# Altium schematic sheet PGOODs.SchDoc
size A; SheetNumber: 7; SheetTotal: 8
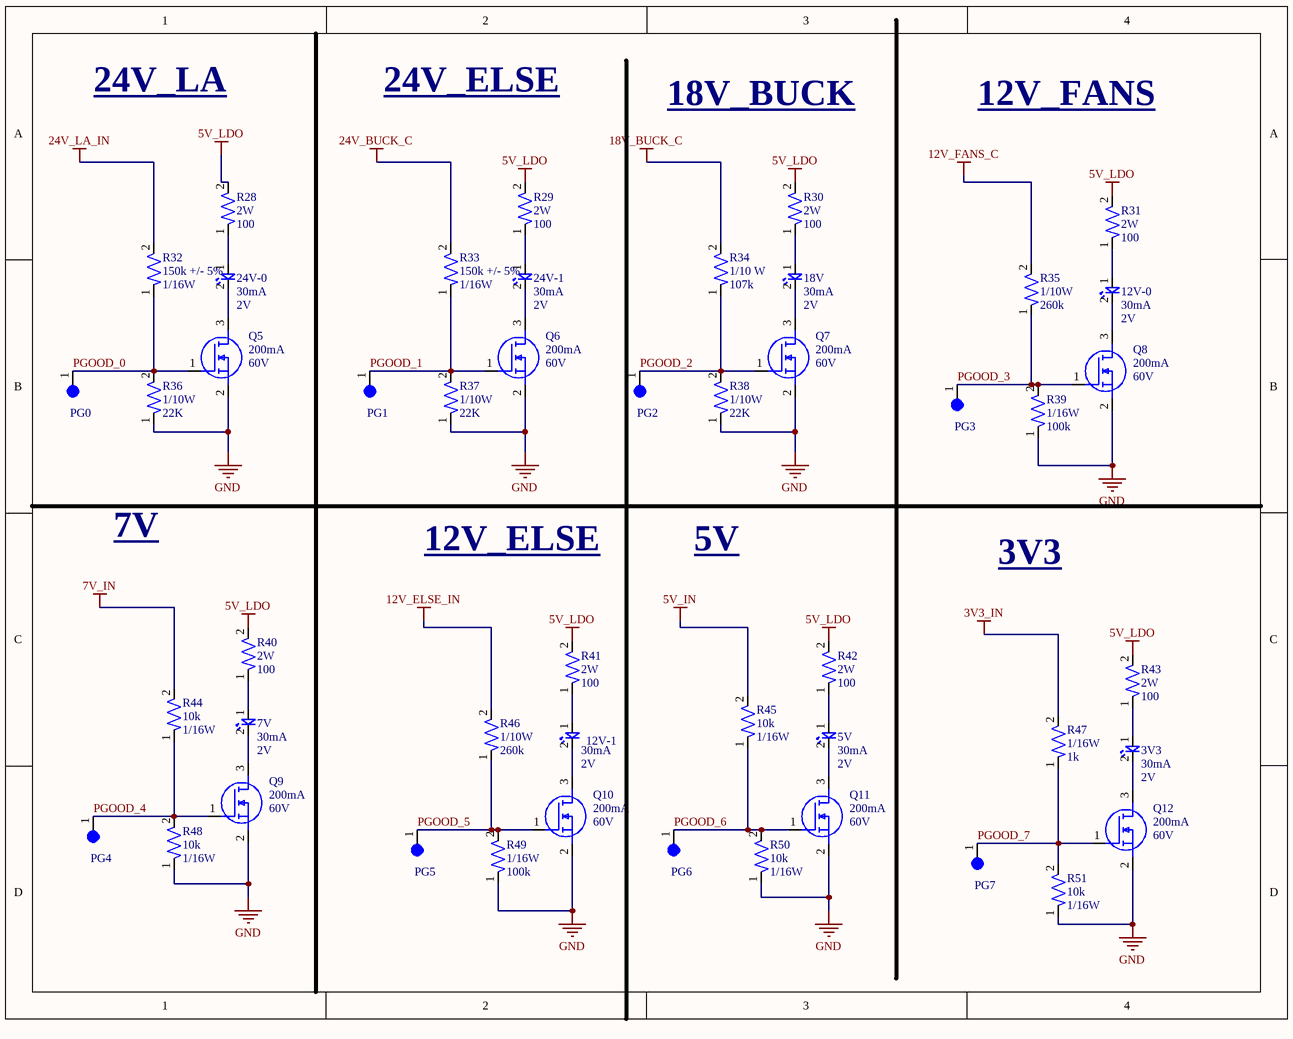
[diagram p0: PGOODs.SchDoc]

## Parts
3V3  Forward Current: 30mA  Forward Voltage: 2V  [LED-0603]  (hidden comment: BL-HKC36G-AV-TRB)
5V  Forward Current: 30mA  Forward Voltage: 2V  [LED-0603]  (hidden comment: BL-HKC36G-AV-TRB)
7V  Forward Current: 30mA  Forward Voltage: 2V  [LED-0603]  (hidden comment: BL-HKC36G-AV-TRB)
12V-0  Forward Current: 30mA  Forward Voltage: 2V  [LED-0603]  (hidden comment: BL-HKC36G-AV-TRB)
12V-1  Forward Current: 30mA  Forward Voltage: 2V  [LED-0603]  (hidden comment: BL-HKC36G-AV-TRB)
18V  Forward Current: 30mA  Forward Voltage: 2V  [LED-0603]  (hidden comment: BL-HKC36G-AV-TRB)
24V-0  Forward Current: 30mA  Forward Voltage: 2V  [LED-0603]  (hidden comment: BL-HKC36G-AV-TRB)
24V-1  Forward Current: 30mA  Forward Voltage: 2V  [LED-0603]  (hidden comment: BL-HKC36G-AV-TRB)
PG0  5003  [TEST-POINT-0001]  (value not drawn)
PG1  5003  [TEST-POINT-0001]  (value not drawn)
PG2  5003  [TEST-POINT-0001]  (value not drawn)
PG3  5003  [TEST-POINT-0001]  (value not drawn)
PG4  5003  [TEST-POINT-0001]  (value not drawn)
PG5  5003  [TEST-POINT-0001]  (value not drawn)
PG6  5003  [TEST-POINT-0001]  (value not drawn)
PG7  5003  [TEST-POINT-0001]  (value not drawn)
Q5  Continuous Current: 200mA  Voltage: 60V  [IC-SOT23-3]  (hidden comment: T2N7002AK,LM)
Q6  Continuous Current: 200mA  Voltage: 60V  [IC-SOT23-3]  (hidden comment: T2N7002AK,LM)
Q7  Continuous Current: 200mA  Voltage: 60V  [IC-SOT23-3]  (hidden comment: T2N7002AK,LM)
Q8  Continuous Current: 200mA  Voltage: 60V  [IC-SOT23-3]  (hidden comment: T2N7002AK,LM)
Q9  Continuous Current: 200mA  Voltage: 60V  [IC-SOT23-3]  (hidden comment: T2N7002AK,LM)
Q10  Continuous Current: 200mA  Voltage: 60V  [IC-SOT23-3]  (hidden comment: T2N7002AK,LM)
Q11  Continuous Current: 200mA  Voltage: 60V  [IC-SOT23-3]  (hidden comment: T2N7002AK,LM)
Q12  Continuous Current: 200mA  Voltage: 60V  [IC-SOT23-3]  (hidden comment: T2N7002AK,LM)
R28  Power: 2W  Resistance: 100  [RES-2512]  (hidden comment: SR2512JK-7W100RL)
R29  Power: 2W  Resistance: 100  [RES-2512]  (hidden comment: SR2512JK-7W100RL)
R30  Power: 2W  Resistance: 100  [RES-2512]  (hidden comment: SR2512JK-7W100RL)
R31  Power: 2W  Resistance: 100  [RES-2512]  (hidden comment: SR2512JK-7W100RL)
R32  Resistance: 150k +/- 5%  Power: 1/16W  [RES-0402]  (hidden comment: RC0603FR-0722KL)
R33  Resistance: 150k +/- 5%  Power: 1/16W  [RES-0402]  (hidden comment: *RC0402JR-07150KL)
R34  Power: 1/10 W  Resistance: 107k  [RES-0603]  (hidden comment: RC0603FR-07107KL)
R35  Power: 1/10W  Resistance: 260k  [RES-0402]  (hidden comment: ERJ-2RKF2743X)
R36  Power: 1/10W  Resistance: 22K  [RES-0603]  (hidden comment: RC0603FR-0722KL)
R37  Power: 1/10W  Resistance: 22K  [RES-0603]  (hidden comment: RC0603FR-0722KL)
R38  Power: 1/10W  Resistance: 22K  [RES-0603]  (hidden comment: RC0603FR-0722KL)
R39  Power: 1/16W  Resistance: 100k  [RES-0402]  (hidden comment: RC0402FR-07100KL)
R40  Power: 2W  Resistance: 100  [RES-2512]  (hidden comment: SR2512JK-7W100RL)
R41  Power: 2W  Resistance: 100  [RES-2512]  (hidden comment: SR2512JK-7W100RL)
R42  Power: 2W  Resistance: 100  [RES-2512]  (hidden comment: SR2512JK-7W100RL)
R43  Power: 2W  Resistance: 100  [RES-2512]  (hidden comment: SR2512JK-7W100RL)
R44  Resistance: 10k  Power: 1/16W  [RES-0402]  (hidden comment: RC0402FR-0710KL)
R45  Resistance: 10k  Power: 1/16W  [RES-0402]  (hidden comment: RC0402FR-0710KL)
R46  Power: 1/10W  Resistance: 260k  [RES-0402]  (hidden comment: ERJ-2RKF2743X)
R47  Power: 1/16W  Resistance: 1k  [RES-0402]  (hidden comment: RC0402FR-071KL)
R48  Resistance: 10k  Power: 1/16W  [RES-0402]  (hidden comment: RC0402FR-0710KL)
R49  Power: 1/16W  Resistance: 100k  [RES-0402]  (hidden comment: RC0402FR-07100KL)
R50  Resistance: 10k  Power: 1/16W  [RES-0402]  (hidden comment: RC0402FR-0710KL)
R51  Resistance: 10k  Power: 1/16W  [RES-0402]  (hidden comment: RC0402FR-0710KL)

## Nets
3V3_IN: R47.2
5V_IN: R45.2
5V_LDO: R28.2 R29.2 R30.2 R31.2 R40.2 R41.2 R42.2 R43.2
7V_IN: R44.2
12V_ELSE_IN: R46.2
12V_FANS_C: R35.2
18V_BUCK_C: R34.2
24V_BUCK_C: R33.2
24V_LA_IN: R32.2
GND: Q5.2(S) Q6.2(S) Q7.2(S) Q8.2(S) Q9.2(S) Q10.2(S) Q11.2(S) Q12.2(S) R36.1 R37.1 R38.1 R39.1 R48.1 R49.1 R50.1 R51.1
PGOOD_0: PG0.1 Q5.1(G) R32.1 R36.2
PGOOD_1: PG1.1 Q6.1(G) R33.1 R37.2
PGOOD_2: PG2.1 Q7.1(G) R34.1 R38.2
PGOOD_3: PG3.1 Q8.1(G) R35.1 R39.2
PGOOD_4: PG4.1 Q9.1(G) R44.1 R48.2
PGOOD_5: PG5.1 Q10.1(G) R46.1 R49.2
PGOOD_6: PG6.1 Q11.1(G) R45.1 R50.2
PGOOD_7: PG7.1 Q12.1(G) R47.1 R51.2
Net3V3_1: 3V3.1 R43.1
Net3V3_2: 3V3.2 Q12.3(D)
Net5V_1: 5V.1 R42.1
Net5V_2: 5V.2 Q11.3(D)
Net7V_1: 7V.1 R40.1
Net7V_2: 7V.2 Q9.3(D)
Net12V-0_1: 12V-0.1 R31.1
Net12V-0_2: 12V-0.2 Q8.3(D)
Net12V-1_1: 12V-1.1 R41.1
Net12V-1_2: 12V-1.2 Q10.3(D)
Net18V_1: 18V.1 R30.1
Net18V_2: 18V.2 Q7.3(D)
Net24V-0_1: 24V-0.1 R28.1
Net24V-0_2: 24V-0.2 Q5.3(D)
Net24V-1_1: 24V-1.1 R29.1
Net24V-1_2: 24V-1.2 Q6.3(D)

## Notes on the sheet
- 24V_LA
- 24V_ELSE
- 18V_BUCK
- 12V_FANS
- 7V
- 12V_ELSE
- 5V
- 3V3

## Library data of the parts
3V3 5V 7V 12V-0 12V-1 18V 24V-0 24V-1 = LED-0001: LED YELLOW CLEAR 0603 SMD; ComponentLink1Description: Datasheet; ComponentLink1URL: https://www.americanbrightled.com/pdffiles/led-components/smt/BL-HKC36G-AV-TRB.pdf
PG0-PG7 = TEST-POINT-0001: Oranange PC Test Point, Miniature Phoisphor Bronze Silver Plating Through Hole Mounting Type
Q5-Q12 = NMOS-200MA-0001: MOSFET N-CH 60V 200MA SOT23; ComponentLink1Description: Datasheet; ComponentLink1URL: https://toshiba.semicon-storage.com/info/T2N7002AK_datasheet_en_20150401.pdf?did=29712&prodName=T2N7002AK
R28-R31 R40-R43 = RES-100-0002: 100 Ohms ±5% 2W Chip Resistor 2512 (6332 Metric) Automotive AEC-Q200, Pulse Withstanding Thick Film
R32 R33 = RES-150K-0001: 150 kOhms ±5% 0.063W, 1/16W Chip Resistor 0402 (1005 Metric) Moisture Resistant Thick Film
R34 = RES-107k-0001: 107 kOhms ±1% 0.1W, 1/10W Chip Resistor 0603 (1608 Metric) Moisture Resistant Thick Film
R35 R46 = RES-260k-0001: RES SMD 274K OHM 1% 1/10W 0402
R36-R38 = RES-22k-0001: 22 kOhms ±1% 0.1W, 1/10W Chip Resistor 0603 (1608 Metric) Moisture Resistant Thick Film; Parameter 1: *
R39 R49 = RES-100k-0002: 100 kOhms ±1% 0.063W, 1/16W Chip Resistor 0402 (1005 Metric) Moisture Resistant Thick Film
R44 R45 R48 R50 R51 = RES-10k-0001: RES 10K OHM 1% 1/16W 0402; Tolerance: 1%; Size: 0402; ComponentLink1Description: Datasheet; ComponentLink1URL: https://www.yageo.com/upload/media/product/products/datasheet/rchip/PYu-RC_Group_51_RoHS_L_12.pdf
R47 = RES-1k-0001: RES 1K OHM 1% 1/16W 0402; Tolerance: 1%; Size: 0402; ComponentLink1Description: Datasheet; ComponentLink1URL: https://www.yageo.com/upload/media/product/products/datasheet/rchip/PYu-RC_Group_51_RoHS_L_12.pdf